# Altium project LoRaIoT.PrjPcb (part 2 of 3)

## Sheet [4] MCU.SchDoc: MCU STM32L052K8U6TR
size A4; CompanyName: RADWAG Wagi Elektroniczne; Organization: RADWAG Wagi Elektroniczne; Address1: ul. Bracka 28; Address2: 26-600 RADOM; Address3: POLAND; SheetNumber: 4; SheetTotal: 6
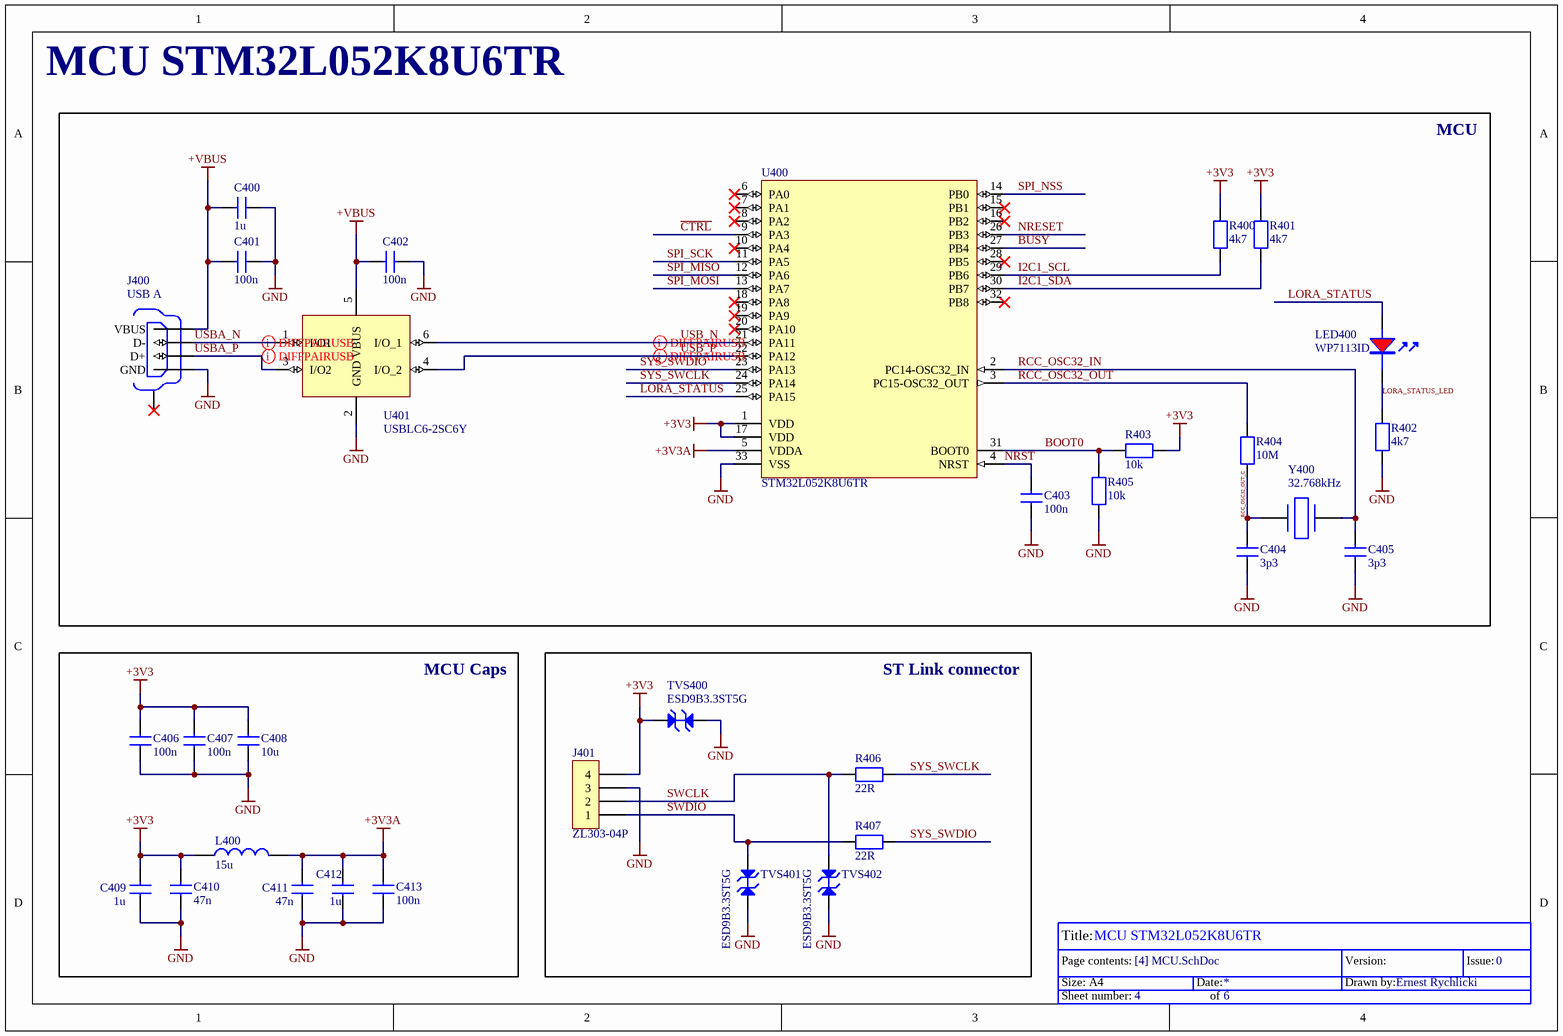
[diagram p3: [4] MCU.SchDoc]

### Parts
C400  1u  [C0402]
C401  100n  [C0402]
C402  100n  [C0402]
C403  100n  [C0603]
C404  3p3  [C0402]
C405  3p3  [C0402]
C406  100n  [C0402]
C407  100n  [C0402]
C408  10u  [C0402]
C409  1u  [C0402]
C410  47n  [C0402]
C411  47n  [C0402]
C412  1u  [C0402]
C413  100n  [C0402]
J400  USB A  [CONN_USB_RT_ANG]
J401  ZL303-04P  [HEADER1X4 _2mm]
L400  15u  [L0805]
LED400  WP7113ID  [LED5mm]
R400  4k7  [R0603]
R401  4k7  [R0603]
R402  4k7  [R0603]
R403  10k  [R0603]
R404  10M  [R0603]
R405  10k  [R0603]
R406  22R  [R0603]
R407  22R  [R0603]
TVS400  ESD9B3.3ST5G  [SOD-923]
TVS401  ESD9B3.3ST5G  [SOD-923]
TVS402  ESD9B3.3ST5G  [SOD-923]
U400  STM32L052K8U6TR  [UFQFPN32]
U401  USBLC6-2SC6Y  [SOT23-6L]
Y400  32.768kHz  [OSCILATOR_2X1_2]

### Blocks framed on the sheet
MCU: C400-C405 J400 LED400 R400-R405 U400 U401 Y400
MCU Caps: C406-C413 L400
ST Link connector: J401 R406 R407 TVS400-TVS402

### Nets
+3V3: C406.2 C407.2 C408.2 C409.2 C410.2 J401.4 L400.1 R400.2 R401.2 R403.1 TVS400.1 U400.1(VDD) U400.17(VDD)
+3V3A: C411.2 C412.2 C413.2 L400.2 U400.5(VDDA)
+VBUS: C400.2 C401.2 C402.2 J400.1(VBUS) U401.5(VBUS)
GND: C400.1 C401.1 C402.1 C403.1 C404.2 C405.2 C406.1 C407.1 C408.1 C409.1 C410.1 C411.1 C412.1 C413.1 J400.4(GND) J401.3 R402.2 R405.1 TVS400.2 TVS401.2 TVS402.2 U400.33(VSS) U401.2(GND)
~{CTRL}: U400.9(PA3)
BOOT0: R403.2 R405.2 U400.31(BOOT0)
BUSY: U400.27(PB4)
I2C1_SCL: R400.1 U400.29(PB6)
I2C1_SDA: R401.1 U400.30(PB7)
LORA_STATUS: LED400.A U400.25(PA15)
LORA_STATUS_LED: LED400.K R402.1
NRESET: U400.26(PB3)
NRST: C403.2 U400.4(NRST)
RCC_OSC32_IN: C405.1 U400.2(PC14-OSC32_IN) Y400.2
RCC_OSC32_OUT: R404.2 U400.3(PC15-OSC32_OUT)
RCC_OSC32_OUT_C: C404.1 R404.1 Y400.1
SPI_MISO: U400.12(PA6)
SPI_MOSI: U400.13(PA7)
SPI_NSS: U400.14(PB0)
SPI_SCK: U400.11(PA5)
SWCLK: J401.2 R406.1 TVS402.1
SWDIO: J401.1 R407.1 TVS401.1
SYS_SWCLK: R406.2 U400.24(PA14)
SYS_SWDIO: R407.2 U400.23(PA13)
USB_N: U400.21(PA11) U401.6(I/O_1)
USB_P: U400.22(PA12) U401.4(I/O_2)
USBA_N: J400.2(D-) U401.1(I/O1)
USBA_P: J400.3(D+) U401.3(I/O2)

Not connected (* = marked no-connect by the designer): J400 0(SHELL)*; U400 6(PA0)* 7(PA1)* 8(PA2)* 10(PA4)* 15(PB1)* 16(PB2)* 18(PA8)* 19(PA9)* 20(PA10)* 28(PB5)* 32(PB8)*

### Layout directives
differential pair; net class USB: USB_N, USB_P, USBA_N, USBA_P

### Notes on the sheet
- Title:
- Size: A4
- Page contents:
- Date:
- Version:
- Drawn by:
- Issue:
- Sheet number:
- of

### Library data of the parts
C400 C409 C412 = 0402X105K100CT: Multilayer Ceramic Capacitor, 1 uF, 10%, X5r, 10 V, 0402 [1005 Metric]; Manufacturer: Walsin Technologies; Supplier: Arrow Electronics; Supplier Part Number: 0402X105K100CT; Manufacturer Part Number: 0402X105K100CT; RoHS: Yes; Category: Ceramic Capacitors; Stock: 760000; Pricing: 10000=0,0037, 20000=0,0027, 50000=0,0026, 100000=0,0025, 250000=0,0023 (USD); ComponentLink1URL: http://www.farnell.com/datasheets/2340522.pdf?src-supplier=Farnell; ComponentLink1Description: http://www.farnell.com/datasheets/2340522.pdf?src-supplier=Farnell; ComponentLink2URL: http://www.farnell.com/datasheets/1958513.pdf?src-supplier=Farnell; ComponentLink2Description: http://www.farnell.com/datasheets/1958513.pdf?src-supplier=Farnell; ComponentLink3URL: http://www.farnell.com/datasheets/1958513.pdf?src-supplier=Element14; ComponentLink3Description: http://www.farnell.com/datasheets/1958513.pdf?src-supplier=Element14; ComponentLink4URL: https://datasheet.octopart.com/0402X105K100CT-Walsin-Technologies-datasheet-128065749.pdf?src-supplier=Future+Electronics; ComponentLink4Description: https://datasheet.octopart.com/0402X105K100CT-Walsin-Technologies-datasheet-128065749.pdf?src-supplier=Future+Electronics; ComponentLink5URL: https://datasheet.octopart.com/0402X105K100CT-Walsin-Technologies-datasheet-62066062.pdf?src-supplier=TME; ComponentLink5Description: https://datasheet.octopart.com/0402X105K100CT-Walsin-Technologies-datasheet-62066062.pdf?src-supplier=TME; ComponentLink6URL: https://datasheet.octopart.com/0402X105K100CT-Walsin-Technologies-datasheet-136037192.pdf?src-supplier=TECHDesign; ComponentLink6Description: https://datasheet.octopart.com/0402X105K100CT-Walsin-Technologies-datasheet-136037192.pdf?src-supplier=TECHDesign
C401 C402 C406 C407 C413 = 04023C104KAT2A: Multilayer Ceramic Capacitor, 0.1 uF, 25 V, ± 10%, X7R, 0402 [1005 Metric]; Manufacturer: Kyocera AVX; Material: 4241ConductorMaterial; Value: 100nF; Voltage Rating: 25V; Supplier: Arrow Electronics; Supplier Part Number: 04023C104KAT2A; Manufacturer Part Number: 04023C104KAT2A; RoHS: Yes; Category: Ceramic Capacitors; Stock: 5700000; Pricing: 10000=0,0064, 20000=0,0061, 30000=0,0058, 50000=0,0052, 100000=0,0042, 150000=0,0038 (USD); Mounting Technology: Surface Mount; Case/Package: 0402; Pins: 2; Case Code (Metric): 1005; Case Code (Imperial): 0402; Min Operating Temperature: -55°C; Max Operating Temperature: 125°C; Tolerance: 10%; Dielectric: X7R; Packaging: Cut Tape; Voltage Rating (DC): 25V; Voltage: 25V; Series: -; Width: 1mm; Reach SVHC Compliant: No; Lead Free: Lead Free; RoHS Compliant: Yes; ComponentLink1URL: https://datasheet.ciiva.com/6265/cx7r-6265272.pdf?src-supplier=Digi-Key; ComponentLink1Description: https://datasheet.ciiva.com/6265/cx7r-6265272.pdf?src-supplier=Digi-Key; ComponentLink2URL: https://datasheet.ciiva.com/1123/1679506-1123344.pdf?src-supplier=Element14; ComponentLink2Description: https://datasheet.ciiva.com/1123/1679506-1123344.pdf?src-supplier=Element14; ComponentLink3URL: https://datasheet.ciiva.com/7709/1679506-7709527.pdf?src-supplier=Element14; ComponentLink3Description: https://datasheet.ciiva.com/7709/1679506-7709527.pdf?src-supplier=Element14; ComponentLink4URL: https://datasheet.ciiva.com/14906/cx7r-14906223.pdf?src-supplier=Digi-Key; ComponentLink4Description: https://datasheet.ciiva.com/14906/cx7r-14906223.pdf?src-supplier=Digi-Key; ComponentLink5URL: https://datasheet.ciiva.com/7614/cx7r-7614663.pdf?src-supplier=Digi-Key; ComponentLink5Description: https://datasheet.ciiva.com/7614/cx7r-7614663.pdf?src-supplier=Digi-Key
C403 = 06033C104K4T2A: 0603 0.1 uF 25 V ±10% Tolerance X7R Automotive Multilayer Ceramic Capacitor; Manufacturer: Kyocera AVX; Supplier: Arrow Electronics; Supplier Part Number: 06033C104K4T2A; Manufacturer Part Number: 06033C104K4T2A; RoHS: Yes; Category: Ceramic Capacitors; Stock: 28000; Pricing: 4000=0,0188, 8000=0,0175, 12000=0,0166, 20000=0,0164, 24000=0,0157, 100000=0,0126 (USD); ComponentLink1URL: https://datasheet.ciiva.com/11503/cauto-11503963.pdf?src-supplier=Avnet; ComponentLink1Description: https://datasheet.ciiva.com/11503/cauto-11503963.pdf?src-supplier=Avnet
C404 C405 = GRM1555C1H3R3BA01D: 0402 3.3 pF 50 V ±0.1 pF Tolerance C0G SMT Multilayer Ceramic Capacitor; Manufacturer: Murata; Supplier: Arrow Electronics; Supplier Part Number: GRM1555C1H3R3BA01D; Manufacturer Part Number: GRM1555C1H3R3BA01D; RoHS: Yes; Category: Ceramic Capacitors; Stock: 38428; Pricing: 1=0,056, 10=0,0157, 25=0,0153, 100=0,0095, 250=0,0094, 500=0,0089, 1000=0,0084, 3000=0,0078, 6000=0,0073, 15000=0,0068, 30000=0,0063 (USD); ComponentLink1URL: https://datasheet.ciiva.com/6270/grm1555c1h3r0wa01-01-6270835.pdf?src-supplier=Digi-Key; ComponentLink1Description: https://datasheet.ciiva.com/6270/grm1555c1h3r0wa01-01-6270835.pdf?src-supplier=Digi-Key; ComponentLink2URL: https://datasheet.ciiva.com/18184/getdatasheetpartid-318269-18184366.pdf?src-supplier=Verical; ComponentLink2Description: https://datasheet.ciiva.com/18184/getdatasheetpartid-318269-18184366.pdf?src-supplier=Verical; ComponentLink3URL: https://datasheet.ciiva.com/11614/product-11614449.pdf?src-supplier=Avnet; ComponentLink3Description: https://datasheet.ciiva.com/11614/product-11614449.pdf?src-supplier=Avnet; ComponentLink4URL: https://datasheet.ciiva.com/3779/grm1555c1h3r3ba0123-3779149.pdf?src-supplier=Arrow+Electronics; ComponentLink4Description: https://datasheet.ciiva.com/3779/grm1555c1h3r3ba0123-3779149.pdf?src-supplier=Arrow+Electronics; ComponentLink5URL: https://datasheet.ciiva.com/6270/partnumbering-e-01-6270837.pdf?src-supplier=Digi-Key; ComponentLink5Description: https://datasheet.ciiva.com/6270/partnumbering-e-01-6270837.pdf?src-supplier=Digi-Key; ComponentLink6URL: https://datasheet.ciiva.com/6270/partnumbering-e-01-6270839.pdf?src-supplier=Digi-Key; ComponentLink6Description: https://datasheet.ciiva.com/6270/partnumbering-e-01-6270839.pdf?src-supplier=Digi-Key
C408 = GRJ155R60J106ME11D: Capacitor Ceramic Mlcc 0402 10UF 6.3V SMD; Manufacturer: Murata; Tolerance: 20%; Supplier: Arrow Electronics; Supplier Part Number: GRJ155R60J106ME11D; Manufacturer Part Number: GRJ155R60J106ME11D; RoHS: Yes; Category: Ceramic Capacitors; Stock: 10000; Pricing: 10000=0,0311, 20000=0,0295, 30000=0,0278, 50000=0,0262, 100000=0,0221, 250000=0,0204 (USD); Mounting Technology: Surface Mount; Case/Package: 0402; Case Code (Metric): 1005; Case Code (Imperial): 0402; Min Operating Temperature: -55°C; Max Operating Temperature: 85°C; Packaging: Cut Tape; Value: 10uF; Voltage Rating: 6.3V; Features: Soft Termination; Series: GRJ; Length: 0.039inch; Width: 0.02inch; Thickness: 0.028inch; RoHS Compliant: Yes; ComponentLink1URL: https://datasheet.octopart.com/GRJ155R60J106ME11D-Murata-datasheet-149522788.pdf?src-supplier=Newark; ComponentLink1Description: https://datasheet.octopart.com/GRJ155R60J106ME11D-Murata-datasheet-149522788.pdf?src-supplier=Newark; ComponentLink2URL: http://psearch.en.murata.com/capacitor/product/GRJ155R60J106ME11%23.pdf?src-supplier=Digi-Key; ComponentLink2Description: http://psearch.en.murata.com/capacitor/product/GRJ155R60J106ME11%23.pdf?src-supplier=Digi-Key; ComponentLink3URL: https://datasheet.octopart.com/GRJ155R60J106ME11D-Murata-datasheet-165579666.pdf?src-supplier=TME; ComponentLink3Description: https://datasheet.octopart.com/GRJ155R60J106ME11D-Murata-datasheet-165579666.pdf?src-supplier=TME
C410 C411 = GRM155R71C473KA01J: Cap Ceramic 0.047uF 16V X7R 10% SMD 0402 125°C Paper T/R; Manufacturer: Murata; Supplier: Arrow Electronics; Supplier Part Number: GRM155R71C473KA01J; Manufacturer Part Number: GRM155R71C473KA01J; RoHS: Yes; Category: Ceramic Capacitors; Stock: 49468; Pricing: 1=0,091, 10=0,01, 25=0,0098, 100=0,0064, 250=0,0063, 500=0,0055, 1000=0,0039, 3000=0,0035, 15000=0,0033, 30000=0,0028 (USD); ComponentLink1URL: https://datasheet.ciiva.com/11608/product-11608168.pdf?src-supplier=Avnet; ComponentLink1Description: https://datasheet.ciiva.com/11608/product-11608168.pdf?src-supplier=Avnet; ComponentLink2URL: https://datasheet.ciiva.com/163/partnumbering-e-01-163786.pdf?src-supplier=Digi-Key; ComponentLink2Description: https://datasheet.ciiva.com/163/partnumbering-e-01-163786.pdf?src-supplier=Digi-Key
J400 = 0676430910: CONN USB RT ANG RECPT TYPE A BLK; Manufacturer: Molex; Supplier: Mouser; Supplier Part Number: 538-67643-0910; Manufacturer Part Number: 0676430910; RoHS: Yes; Stock: 4035; Pricing: 1=1,46, 10=1,13, 50=1,13, 100=1,05, 1000=0,894, 10000=0,83 (USD); ComponentLink1URL: https://datasheet.ciiva.com/6733/676430910-sd-6733437.pdf?src-supplier=Digi-Key; ComponentLink1Description: https://datasheet.ciiva.com/6733/676430910-sd-6733437.pdf?src-supplier=Digi-Key
J401 = ZL303-04P: Pin Header, 4-Pin, 2mm
L400 = MLZ2012M150WT000: Inductor Power Shielded Multi-Layer 15uH 20% 2MHz Ferrite 0.25A 1.235Ohm DCR 0805 T/R; Manufacturer: TDK; Self Resonant Frequency: 40MHz; Saturation Current: 120mA; DC Resistance (DCR): 950mR; Supplier: Arrow Electronics; Supplier Part Number: MLZ2012M150WT000; Manufacturer Part Number: MLZ2012M150WT000; RoHS: Yes; Category: Fixed Inductors; Stock: 2000; Pricing: 2000=0,039, 10000=0,037, 24000=0,036, 50000=0,035, 100000=0,034 (USD); Mounting Technology: Surface Mount; Case/Package: 0805; Case Code (Metric): 2012; Case Code (Imperial): 0805; Core Material: Ferrite; Min Operating Temperature: -55°C; Max Operating Temperature: 125°C; Packaging: Cut Tape; Value: 15uH; Tolerance: 20%; Shielding: Shielded; Test Frequency: 2MHz; Series: MLZ; RoHS Compliant: Yes; ComponentLink1URL: https://datasheet.ciiva.com/29690/inductor-commercial-decoupling-mlz-en-29690328.pdf?src-supplier=Digi-Key; ComponentLink1Description: https://datasheet.ciiva.com/29690/inductor-commercial-decoupling-mlz-en-29690328.pdf?src-supplier=Digi-Key; ComponentLink2URL: https://datasheet.ciiva.com/29690/inductor-commercial-decoupling-mlz-en-29690327.pdf?src-supplier=Digi-Key; ComponentLink2Description: https://datasheet.ciiva.com/29690/inductor-commercial-decoupling-mlz-en-29690327.pdf?src-supplier=Digi-Key; ComponentLink3URL: https://datasheet.ciiva.com/29690/inductor-commercial-decoupling-mlz-en-29690329.pdf?src-supplier=Digi-Key; ComponentLink3Description: https://datasheet.ciiva.com/29690/inductor-commercial-decoupling-mlz-en-29690329.pdf?src-supplier=Digi-Key
LED400 = WP7113ID: Red T-1 3/4 5 mm 30° 50 mcd 2.2 V Tinted Solid State LED Lamp Through Hole; Manufacturer: Kingbright; Supplier: Mouser; Supplier Part Number: 604-WP7113ID; Manufacturer Part Number: WP7113ID; RoHS: Yes; Category: LEDs; Stock: 35900; Pricing: 1=0,1, 10=0,072, 50=0,072, 100=0,072, 1000=0,068, 10000=0,06 (USD); ComponentLink1URL: https://datasheet.ciiva.com/2114/wp7113id-2114384.pdf?src-supplier=Digi-Key; ComponentLink1Description: https://datasheet.ciiva.com/2114/wp7113id-2114384.pdf?src-supplier=Digi-Key; ComponentLink2URL: https://datasheet.ciiva.com/4692/wp7113id-48891-4692862.pdf?src-supplier=Mouser; ComponentLink2Description: https://datasheet.ciiva.com/4692/wp7113id-48891-4692862.pdf?src-supplier=Mouser; ComponentLink3URL: https://datasheet.ciiva.com/16210/wp7113id-16210118.pdf?src-supplier=Future+Electronics; ComponentLink3Description: https://datasheet.ciiva.com/16210/wp7113id-16210118.pdf?src-supplier=Future+Electronics
R400-R402 = AF0603FR-074K7L: Res Thick Film 0603 4.7K Ohm 1% 1/10W ±100ppm/°C Molded SMD Paper T/R; Manufacturer: Yageo; Supplier: Arrow Electronics; Supplier Part Number: AF0603FR-074K7L; Manufacturer Part Number: AF0603FR-074K7L; RoHS: Yes; Category: Chip SMD Resistors; Stock: 178; Pricing: 1=0,0339, 10=0,0163, 25=0,0156, 100=0,0114 (USD); ComponentLink1URL: http://www.mouser.com/ds/2/447/PYu-AF_51_RoHS_L_5-1085711.pdf?src-supplier=Mouser; ComponentLink1Description: http://www.mouser.com/ds/2/447/PYu-AF_51_RoHS_L_5-1085711.pdf?src-supplier=Mouser; ComponentLink2URL: https://datasheet.octopart.com/AF0603FR-074K7L-Yageo-datasheet-164730775.pdf?src-supplier=Future+Electronics; ComponentLink2Description: https://datasheet.octopart.com/AF0603FR-074K7L-Yageo-datasheet-164730775.pdf?src-supplier=Future+Electronics; ComponentLink3URL: http://www.yageo.com/documents/recent/PYu-AF_51_RoHS_L_5.pdf?src-supplier=Digi-Key; ComponentLink3Description: http://www.yageo.com/documents/recent/PYu-AF_51_RoHS_L_5.pdf?src-supplier=Digi-Key
R403 R405 = AC0603JR-0710KL: SMD Chip Resistor, 10 kOhm, ± 5%, 100 mW, 0603 [1608 Metric], Thick Film, General Purpose; Manufacturer: Yageo; Voltage Rating: 50V; Value: 10kR; Power Rating: 100mW; Temperature Coefficient: 100ppm/°C; Supplier: Arrow Electronics; Supplier Part Number: AC0603JR-0710KL; Manufacturer Part Number: AC0603JR-0710KL; RoHS: Yes; Category: Chip SMD Resistors; Stock: 801; Pricing: 1=0,0527, 10=0,012, 25=0,0107, 100=0,007, 250=0,0069, 500=0,0062 (USD); Case/Package: 0603; Case Code (Imperial): 0603; Case Code (Metric): 1608; Min Operating Temperature: -55°C; Max Operating Temperature: 155°C; Packaging: Tape and Reel; Tolerance: 5%; Termination: SMD/SMT; Number of Terminations: 2; Max Power Dissipation: 100mW; Features: Moisture Resistant,Automotive AEC-Q200; Series: AC; Ratings: AEC-Q200; Lead Free: Lead Free; RoHS Compliant: Yes; ComponentLink1URL: https://datasheet.ciiva.com/5562/pyu-ac-51-rohs-l-2-5562553.pdf?src-supplier=Mouser; ComponentLink1Description: https://datasheet.ciiva.com/5562/pyu-ac-51-rohs-l-2-5562553.pdf?src-supplier=Mouser
R404 = RC0603FR-0710ML: SMD Chip Resistor, 10 MOhm, ± 1%, 100 mW, 0603 [1608 Metric], Thick Film, General Purpose; Manufacturer: Yageo; Voltage Rating: 50V; Value: 10MR; Power Rating: 100mW; Tolerance: 5%; Temperature Coefficient: 100ppm/°C; Supplier: Arrow Electronics; Supplier Part Number: RC0603FR-0710ML; Manufacturer Part Number: RC0603FR-0710ML; RoHS: Yes; Category: Chip SMD Resistors; Stock: 125000; Pricing: 5000=0,002 (USD); Case/Package: 0603; Pins: 2; Case Code (Metric): 1608; Case Code (Imperial): 0603; Min Operating Temperature: -55°C; Max Operating Temperature: 155°C; Voltage Rating (DC): 50V; Packaging: Tape and Reel; Resistor Type: Thick Film; Number of Terminations: 2; Termination: SMD/SMT; Max Power Dissipation: 100mW; Features: Moisture Resistant; Series: RC; Resistance Tolerance: 1%; Construction: Rectangular; Technology: THICK FILM; Voltage Rating (AC): 50V; Length: 1.6mm; Width: 0.8mm; Height: 0.45mm; Depth: 0.8mm; Reach SVHC Compliant: No; Military Standard: Not; RoHS Compliant: Yes; Lead Free: 5697LeadFree; ComponentLink1URL: https://datasheet.ciiva.com/11808/0900766b80f96399-11808122.pdf?src-supplier=Rs; ComponentLink1Description: https://datasheet.ciiva.com/11808/0900766b80f96399-11808122.pdf?src-supplier=Rs; ComponentLink2URL: https://datasheet.ciiva.com/22763/1686128-22763599.pdf?src-supplier=Farnell; ComponentLink2Description: https://datasheet.ciiva.com/22763/1686128-22763599.pdf?src-supplier=Farnell; ComponentLink3URL: https://datasheet.ciiva.com/46393/1868787-46393000.pdf?src-supplier=Element14; ComponentLink3Description: https://datasheet.ciiva.com/46393/1868787-46393000.pdf?src-supplier=Element14; ComponentLink4URL: https://datasheet.ciiva.com/2453/pyu-r-int-thick-7-2453905.pdf?src-supplier=Digi-Key; ComponentLink4Description: https://datasheet.ciiva.com/2453/pyu-r-int-thick-7-2453905.pdf?src-supplier=Digi-Key; ComponentLink5URL: https://datasheet.ciiva.com/2453/pyu-r-int-thick-7-2453906.pdf?src-supplier=Digi-Key; ComponentLink5Description: https://datasheet.ciiva.com/2453/pyu-r-int-thick-7-2453906.pdf?src-supplier=Digi-Key; ComponentLink6URL: https://datasheet.ciiva.com/2453/pyu-r-int-thick-7-2453904.pdf?src-supplier=Digi-Key; ComponentLink6Description: https://datasheet.ciiva.com/2453/pyu-r-int-thick-7-2453904.pdf?src-supplier=Digi-Key
R406 R407 = RC0603JR-0722RL: SMD Chip Resistor, 22 Ohm, ± 5%, 100 mW, 0603 [1608 Metric], Thick Film, General Purpose; Manufacturer: Yageo; Voltage Rating (AC): 50V; Supplier: Arrow Electronics; Supplier Part Number: RC0603JR-0722RL; Manufacturer Part Number: RC0603JR-0722RL; RoHS: Yes; Category: Chip SMD Resistors; Stock: 4035; Pricing: 1=0,0925, 10=0,0259, 25=0,0135, 100=0,005, 250=0,0047, 500=0,0043, 1000=0,0042, 3000=0,0026 (USD); ComponentLink1URL: https://datasheet.ciiva.com/7746/443971-7746471.pdf?src-supplier=Element14; ComponentLink1Description: https://datasheet.ciiva.com/7746/443971-7746471.pdf?src-supplier=Element14; ComponentLink2URL: https://datasheet.ciiva.com/7746/443971-7746472.pdf?src-supplier=Element14; ComponentLink2Description: https://datasheet.ciiva.com/7746/443971-7746472.pdf?src-supplier=Element14; ComponentLink3URL: https://datasheet.ciiva.com/46394/443971-46394999.pdf?src-supplier=Element14; ComponentLink3Description: https://datasheet.ciiva.com/46394/443971-46394999.pdf?src-supplier=Element14; ComponentLink4URL: https://datasheet.ciiva.com/15189/getdatasheetpartid-493085-15189862.pdf?src-supplier=Verical; ComponentLink4Description: https://datasheet.ciiva.com/15189/getdatasheetpartid-493085-15189862.pdf?src-supplier=Verical
TVS400-TVS402 = ESD9B3.3ST5G: 11.5V 2A 3.3V (Max) 5V Bidirectional SOD-923 ESD Protection Devices ROHS; Manufacturer: ON Semiconductor; Number of Bidirectional Channels: 1; Power Line Protection: No; Diode Type: ZENER; Value: 15pF; Clamping Voltage: 10.5V; Leakage Current: 1uA; Peak Pulse Power: 300mW; ESD Protection: Yes; Test Current: 1mA; Supplier: Arrow Electronics; Supplier Part Number: ESD9B3.3ST5G; Manufacturer Part Number: ESD9B3.3ST5G; RoHS: Yes; Category: ESD and Circuit Protection ICs; Stock: 102; Pricing: 1=0,1559, 10=0,1305, 25=0,108, 100=0,067 (USD); Case/Package: SOD-923-2; Pins: 2; Min Operating Temperature: -55°C; Max Operating Temperature: 150°C; Packaging: Tape and Reel; Operating Supply Voltage: 3.3V; Reverse Standoff Voltage: 3.3V; Min Breakdown Voltage: 5V; Peak Pulse Current: 2A; Series: -; Package Quantity: 8000; Number of Elements: 1; Reverse Breakdown Voltage: 5V; Direction: Bidirectional; Breakdown Voltage: 5V; Number of Channels: 1; Polarity: Bidirectional; Termination: SMD/SMT; Working Voltage: 3.3V; Max Reverse Leakage Current: 1uA; Max Power Dissipation: 300mW; Number of Lines: 1; Length: 0.8mm; Width: 0.65mm; Height: 0.4mm; Depth: 0.6mm; Radiation Hardening: No; Lead Free: Lead Free; Reach SVHC Compliant: No; Halogen Free: Halogen Free; RoHS Compliant: Yes; ComponentLink1URL: https://datasheet.ciiva.com/339/esd9b-d-339712.pdf?src-supplier=Mouser; ComponentLink1Description: https://datasheet.ciiva.com/339/esd9b-d-339712.pdf?src-supplier=Mouser; ComponentLink2URL: https://datasheet.ciiva.com/22642/1596367-22642026.pdf?src-supplier=Element14; ComponentLink2Description: https://datasheet.ciiva.com/22642/1596367-22642026.pdf?src-supplier=Element14; ComponentLink3URL: https://datasheet.ciiva.com/22642/1596367-22642028.pdf?src-supplier=Element14; ComponentLink3Description: https://datasheet.ciiva.com/22642/1596367-22642028.pdf?src-supplier=Element14; ComponentLink4URL: https://datasheet.ciiva.com/11193/esd9b-d-11193999.pdf?src-supplier=Avnet; ComponentLink4Description: https://datasheet.ciiva.com/11193/esd9b-d-11193999.pdf?src-supplier=Avnet; ComponentLink5URL: https://datasheet.ciiva.com/26917/getdatasheetpartid-292713-26917946.pdf?src-supplier=Verical; ComponentLink5Description: https://datasheet.ciiva.com/26917/getdatasheetpartid-292713-26917946.pdf?src-supplier=Verical
U400 = STM32L052K8U6TR: Ultra-low power ARM Cortex-M0+ MCU with 64-Kbyte Flash, 32 MHz CPU, USB; Manufacturer: STMicroelectronics; Number of Timers/Counters: 4NUMBER; Density: 64KB; Nominal Supply Current: 290nA; Number of Channels: 10NUMBER; Number of D/A Converters: 1NUMBER; Supplier: Mouser; Supplier Part Number: 511-STM32L052K8U6TR; Manufacturer Part Number: STM32L052K8U6TR; RoHS: Yes; Category: Microcontrollers; Stock: 12130; Pricing: 1=4,52, 10=4,06, 50=3,84, 100=3,33, 1000=2,39, 10000=2,19 (USD); Number of I2C Channels: 1NUMBER; Number of SPI Channels: 1NUMBER; ComponentLink1URL: http://www.mouser.com/ds/2/389/stm32l052c6-956243.pdf?src-supplier=Mouser; ComponentLink1Description: http://www.mouser.com/ds/2/389/stm32l052c6-956243.pdf?src-supplier=Mouser; ComponentLink2URL: http://www.farnell.com/datasheets/1964277.pdf?src-supplier=Farnell; ComponentLink2Description: http://www.farnell.com/datasheets/1964277.pdf?src-supplier=Farnell; ComponentLink3URL: http://www.st.com/content/ccc/resource/technical/document/datasheet/dc/d6/6d/24/86/2a/40/d3/DM00108217.pdf/files/DM00108217.pdf/jcr:content/translations/en.DM00108217.pdf?src-supplier=Digi-Key; ComponentLink3Description: http://www.st.com/content/ccc/resource/technical/document/datasheet/dc/d6/6d/24/86/2a/40/d3/DM00108217.pdf/files/DM00108217.pdf/jcr:content/translations/en.DM00108217.pdf?src-supplier=Digi-Key; ComponentLink4URL: https://datasheet.octopart.com/STM32L052K8U6TR-STMicroelectronics-datasheet-62336777.pdf?src-supplier=Future+Electronics; ComponentLink4Description: https://datasheet.octopart.com/STM32L052K8U6TR-STMicroelectronics-datasheet-62336777.pdf?src-supplier=Future+Electronics; ComponentLink5URL: http://www.st.com/st-web-ui/static/active/en/resource/technical/document/datasheet/DM00108217.pdf?src-supplier=Avnet; ComponentLink5Description: http://www.st.com/st-web-ui/static/active/en/resource/technical/document/datasheet/DM00108217.pdf?src-supplier=Avnet; ComponentLink6URL: https://datasheet.octopart.com/STM32L052K8U6TR-STMicroelectronics-datasheet-48110660.pdf?src-supplier=Newark; ComponentLink6Description: https://datasheet.octopart.com/STM32L052K8U6TR-STMicroelectronics-datasheet-48110660.pdf?src-supplier=Newark; ComponentLink7URL: https://datasheet.octopart.com/STM32L052K8U6TR-STMicroelectronics-datasheet-38726991.pdf?src-supplier=Element14; ComponentLink7Description: https://datasheet.octopart.com/STM32L052K8U6TR-STMicroelectronics-datasheet-38726991.pdf?src-supplier=Element14; ComponentLink8URL: https://datasheet.octopart.com/STM32L052K8U6TR-STMicroelectronics-datasheet-159009248.pdf?src-supplier=SHENGYU+ELECTRONICS; ComponentLink8Description: https://datasheet.octopart.com/STM32L052K8U6TR-STMicroelectronics-datasheet-159009248.pdf?src-supplier=SHENGYU+ELECTRONICS
U401 = USBLC6-2SC6Y: USBLC6 Series 2 Line 6 V Uni / Bi Directional ESD Protection - SOT-23-6; Manufacturer: STMicroelectronics; Direction: Unidirectional; Value: 3.5pF; Operating Supply Voltage: 1.1V; Number of Bidirectional Channels: 2; Reverse Standoff Voltage: 5.25V; Min Breakdown Voltage: 6V; Clamping Voltage: 17V; Power Line Protection: Yes; Leakage Current: 150nA; Test Current: 1mA; ESR: 330R; Peak Pulse Current: 5A; Supplier: Mouser; Supplier Part Number: 511-USBLC6-2SC6Y; Manufacturer Part Number: USBLC6-2SC6Y; RoHS: Yes; Category: TVS Diodes; Stock: 6497; Pricing: 1=0,94, 10=0,847, 50=0,847, 100=0,691, 1000=0,541, 10000=0,426 (USD); Mounting Technology: Surface Mount; Case/Package: SOT-23; Pins: 6; Min Operating Temperature: -40°C; Max Operating Temperature: 150°C; Packaging: Tape and Reel; Package Quantity: 1; Number of Channels: 2; Breakdown Voltage: 6V; Termination: SMD/SMT; ESD Protection: Yes; Max Reverse Leakage Current: 150nA; Series: Automotive, AEC-Q101, USBY; Number of Unidirectional Channels: 2; Length: 3mm; Width: 1.75mm; Height: 1.45mm; Depth: 1.75mm; Radiation Hardening: No; Reach SVHC Compliant: No; Lead Free: Lead Free; RoHS Compliant: Yes; ComponentLink1URL: https://datasheet.ciiva.com/12326/dm00055262-101391-12326647.pdf?src-supplier=Mouser; ComponentLink1Description: https://datasheet.ciiva.com/12326/dm00055262-101391-12326647.pdf?src-supplier=Mouser; ComponentLink2URL: https://datasheet.ciiva.com/338/dm00055262-338888.pdf?src-supplier=Digi-Key; ComponentLink2Description: https://datasheet.ciiva.com/338/dm00055262-338888.pdf?src-supplier=Digi-Key; ComponentLink3URL: https://datasheet.ciiva.com/338/dm00055262-338887.pdf?src-supplier=Digi-Key; ComponentLink3Description: https://datasheet.ciiva.com/338/dm00055262-338887.pdf?src-supplier=Digi-Key; ComponentLink4URL: https://datasheet.ciiva.com/338/dm00055262-338889.pdf?src-supplier=Digi-Key; ComponentLink4Description: https://datasheet.ciiva.com/338/dm00055262-338889.pdf?src-supplier=Digi-Key; ComponentLink5URL: https://datasheet.ciiva.com/41442/001183856-da-01-en-diode-esd-2lin-usblc6-2sc6y-sot-23-6-stm-41442876.pdf?src-supplier=Conrad; ComponentLink5Description: https://datasheet.ciiva.com/41442/001183856-da-01-en-diode-esd-2lin-usblc6-2sc6y-sot-23-6-stm-41442876.pdf?src-supplier=Conrad
Y400 = CM8V-T1A 32.768kHz 7pF +/-20ppm TA QC: Tuning Fork Crystal SMD 32.768kHz 1.2x2.0mm; Manufacturer: Micro Crystal; Load Capacitance: 7pF; Frequency Tolerance: 20ppm; Supplier: Digi-Key; Supplier Part Number: 2195-CM8V-T1A-32.768KHZ-7PF-20PPM-TA-QCCT-ND; Manufacturer Part Number: CM8V-T1A 32.768kHz 7pF +/-20ppm TA QC; RoHS: Yes; Category: Uncategorized; Stock: 101880; Pricing: 1=0,6, 10=0,502, 50=0,4522, 100=0,402, 500=0,38188 (USD); Case/Package: SMD/SMT; Min Operating Temperature: -40°C; Max Operating Temperature: 85°C; Frequency: 32.768kHz; Length: 2mm; Width: 1.2mm; Height: 0.6mm; ComponentLink1URL: https://datasheet.ciiva.com/29123/001009262-da-01-en-uhrenquarz-cm8v-t1a-32-768-247-smd-29123814.pdf?src-supplier=Conrad; ComponentLink1Description: https://datasheet.ciiva.com/29123/001009262-da-01-en-uhrenquarz-cm8v-t1a-32-768-247-smd-29123814.pdf?src-supplier=Conrad

## Sheet [5] POWER.SchDoc: Power
size A4; CompanyName: RADWAG Wagi Elektroniczne; Organization: RADWAG Wagi Elektroniczne; Address1: ul. Bracka 28; Address2: 26-600 RADOM; Address3: POLAND; SheetNumber: 5; SheetTotal: 6
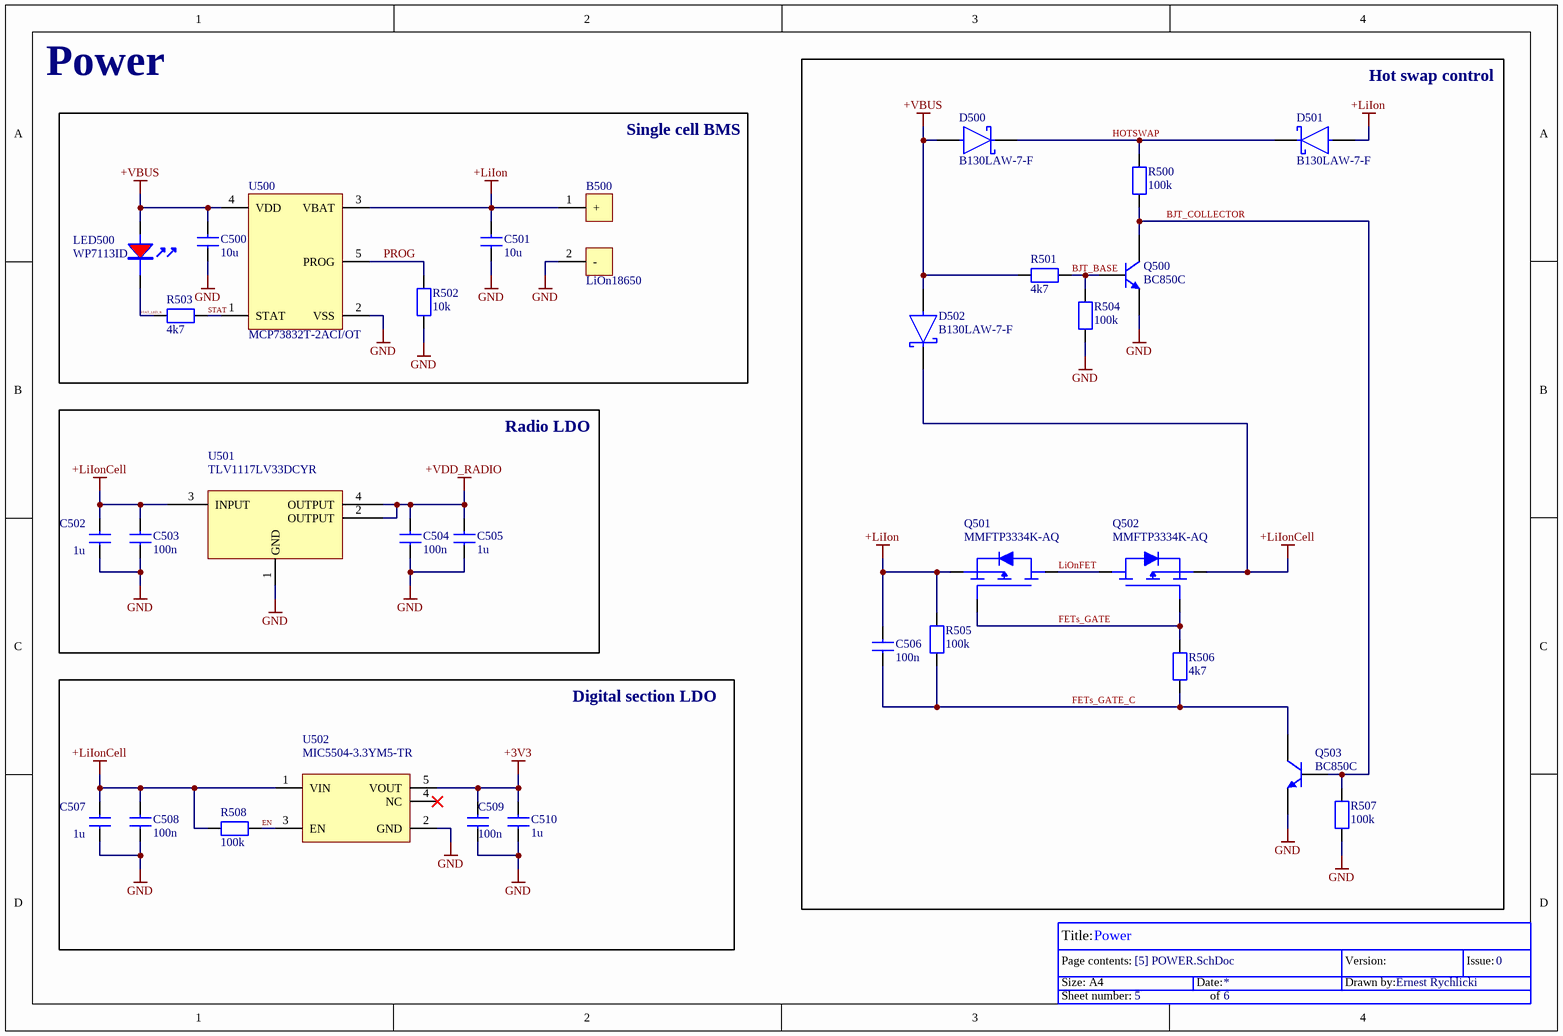
[diagram p4: [5] POWER.SchDoc]

### Parts
B500  LiOn18650  [LION18650]  (no BOM)
C500  10u  [C0402]
C501  10u  [C0402]
C502  1u  [C0402]
C503  100n  [C0402]
C504  100n  [C0402]
C505  1u  [C0402]
C506  100n  [C0402]
C507  1u  [C0402]
C508  100n  [C0402]
C509  100n  [C0402]
C510  1u  [C0402]
D500  B130LAW-7-F  [SOD-123]
D501  B130LAW-7-F  [SOD-123]
D502  B130LAW-7-F  [SOD-123]
LED500  WP7113ID  [LED5mm]
Q500  BC850C  [SOT23]
Q501  MMFTP3334K-AQ  [SOT23]
Q502  MMFTP3334K-AQ  [SOT23]
Q503  BC850C  [SOT23]
R500  100k  [R0603]
R501  4k7  [R0603]
R502  10k  [R0603]
R503  4k7  [R0603]
R504  100k  [R0603]
R505  100k  [R0603]
R506  4k7  [R0603]
R507  100k  [R0603]
R508  100k  [R0603]
U500  MCP73832T-2ACI/OT  [SOT23-5]
U501  TLV1117LV33DCYR  [SOT223-4]
U502  MIC5504-3.3YM5-TR  [SOT23-5]

### Blocks framed on the sheet
Hot swap control: C506 D500-D502 Q500-Q503 R500 R501 R504-R507
Single cell BMS: B500 C500 C501 LED500 R502 R503 U500
Radio LDO: C502-C505 U501
Digital section LDO: C507-C510 R508 U502

### Nets
+3V3: C509.2 C510.2 U502.5(VOUT)
+LiIon: B500.1(+) C501.2 C506.2 D501.2(A) Q501.2(S) R505.2 U500.3(VBAT)
+LiIonCell: C502.2 C503.2 C507.2 C508.2 D502.1(C) Q502.2(S) R508.2 U501.3(INPUT) U502.1(VIN)
+VBUS: C500.2 D500.2(A) D502.2(A) LED500.A R501.2 U500.4(VDD)
+VDD_RADIO: C504.2 C505.2 U501.2(OUTPUT) U501.4(OUTPUT)
GND: B500.2(-) C500.1 C501.1 C502.1 C503.1 C504.1 C505.1 C507.1 C508.1 C509.1 C510.1 Q500.2(E) Q503.2(E) R502.1 R504.1 R507.1 U500.2(VSS) U501.1(GND) U502.2(GND)
BJT_BASE: Q500.1(B) R501.1 R504.2
BJT_COLLECTOR: Q500.3(C) Q503.1(B) R500.1 R507.2
EN: R508.1 U502.3(EN)
FETs_GATE: Q501.1(G) Q502.1(G) R506.1
FETs_GATE_C: C506.1 Q503.3(C) R505.1 R506.2
HOTSWAP: D500.1(C) D501.1(C) R500.2
LiOnFET: Q501.3(D) Q502.3(D)
PROG: R502.2 U500.5(PROG)
STAT: R503.1 U500.1(STAT)
STAT_LED_K: LED500.K R503.2

Not connected (* = marked no-connect by the designer): U502 4(NC)*

### Notes on the sheet
- Title:
- Size: A4
- Page contents:
- Date:
- Version:
- Drawn by:
- Issue:
- Sheet number:
- of

### Library data of the parts
B500 = LiOn18650: LiOn18650 - single cell battery, soldered to PCB
C500 C501 = GRJ155R60J106ME11D: as C408 on sheet [4] MCU; Supplier: Arrow Electronics; Supplier Part Number: GRJ155R60J106ME11D; Manufacturer Part Number: GRJ155R60J106ME11D; RoHS: Yes; Category: Ceramic Capacitors; Stock: 10000; Pricing: 10000=0,0311, 20000=0,0295, 30000=0,0278, 50000=0,0262, 100000=0,0221, 250000=0,0204 (USD); Mounting Technology: Surface Mount; Case/Package: 0402; Case Code (Metric): 1005; Case Code (Imperial): 0402; Min Operating Temperature: -55°C; Max Operating Temperature: 85°C; Packaging: Cut Tape; Value: 10uF; Voltage Rating: 6.3V; Features: Soft Termination; Series: GRJ; Length: 0.039inch; Width: 0.02inch; Thickness: 0.028inch; RoHS Compliant: Yes; ComponentLink1URL: https://datasheet.octopart.com/GRJ155R60J106ME11D-Murata-datasheet-149522788.pdf?src-supplier=Newark; ComponentLink1Description: https://datasheet.octopart.com/GRJ155R60J106ME11D-Murata-datasheet-149522788.pdf?src-supplier=Newark; ComponentLink2URL: http://psearch.en.murata.com/capacitor/product/GRJ155R60J106ME11%23.pdf?src-supplier=Digi-Key; ComponentLink2Description: http://psearch.en.murata.com/capacitor/product/GRJ155R60J106ME11%23.pdf?src-supplier=Digi-Key; ComponentLink3URL: https://datasheet.octopart.com/GRJ155R60J106ME11D-Murata-datasheet-165579666.pdf?src-supplier=TME; ComponentLink3Description: https://datasheet.octopart.com/GRJ155R60J106ME11D-Murata-datasheet-165579666.pdf?src-supplier=TME
C502 C505 C507 C510 = 0402X105K100CT: as C400 on sheet [4] MCU; Supplier: Arrow Electronics; Supplier Part Number: 0402X105K100CT; Manufacturer Part Number: 0402X105K100CT; RoHS: Yes; Category: Ceramic Capacitors; Stock: 760000; Pricing: 10000=0,0037, 20000=0,0027, 50000=0,0026, 100000=0,0025, 250000=0,0023 (USD); ComponentLink1URL: http://www.farnell.com/datasheets/2340522.pdf?src-supplier=Farnell; ComponentLink1Description: http://www.farnell.com/datasheets/2340522.pdf?src-supplier=Farnell; ComponentLink2URL: http://www.farnell.com/datasheets/1958513.pdf?src-supplier=Farnell; ComponentLink2Description: http://www.farnell.com/datasheets/1958513.pdf?src-supplier=Farnell; ComponentLink3URL: http://www.farnell.com/datasheets/1958513.pdf?src-supplier=Element14; ComponentLink3Description: http://www.farnell.com/datasheets/1958513.pdf?src-supplier=Element14; ComponentLink4URL: https://datasheet.octopart.com/0402X105K100CT-Walsin-Technologies-datasheet-128065749.pdf?src-supplier=Future+Electronics; ComponentLink4Description: https://datasheet.octopart.com/0402X105K100CT-Walsin-Technologies-datasheet-128065749.pdf?src-supplier=Future+Electronics; ComponentLink5URL: https://datasheet.octopart.com/0402X105K100CT-Walsin-Technologies-datasheet-62066062.pdf?src-supplier=TME; ComponentLink5Description: https://datasheet.octopart.com/0402X105K100CT-Walsin-Technologies-datasheet-62066062.pdf?src-supplier=TME; ComponentLink6URL: https://datasheet.octopart.com/0402X105K100CT-Walsin-Technologies-datasheet-136037192.pdf?src-supplier=TECHDesign; ComponentLink6Description: https://datasheet.octopart.com/0402X105K100CT-Walsin-Technologies-datasheet-136037192.pdf?src-supplier=TECHDesign
C503 C504 C506 C508 C509 = 04023C104KAT2A: as C401 on sheet [4] MCU; Supplier: Arrow Electronics; Supplier Part Number: 04023C104KAT2A; Manufacturer Part Number: 04023C104KAT2A; RoHS: Yes; Category: Ceramic Capacitors; Stock: 5700000; Pricing: 10000=0,0064, 20000=0,0061, 30000=0,0058, 50000=0,0052, 100000=0,0042, 150000=0,0038 (USD); Mounting Technology: Surface Mount; Case/Package: 0402; Pins: 2; Case Code (Metric): 1005; Case Code (Imperial): 0402; Min Operating Temperature: -55°C; Max Operating Temperature: 125°C; Tolerance: 10%; Dielectric: X7R; Packaging: Cut Tape; Voltage Rating (DC): 25V; Voltage: 25V; Series: -; Width: 1mm; Reach SVHC Compliant: No; Lead Free: Lead Free; RoHS Compliant: Yes; ComponentLink1URL: https://datasheet.ciiva.com/6265/cx7r-6265272.pdf?src-supplier=Digi-Key; ComponentLink1Description: https://datasheet.ciiva.com/6265/cx7r-6265272.pdf?src-supplier=Digi-Key; ComponentLink2URL: https://datasheet.ciiva.com/1123/1679506-1123344.pdf?src-supplier=Element14; ComponentLink2Description: https://datasheet.ciiva.com/1123/1679506-1123344.pdf?src-supplier=Element14; ComponentLink3URL: https://datasheet.ciiva.com/7709/1679506-7709527.pdf?src-supplier=Element14; ComponentLink3Description: https://datasheet.ciiva.com/7709/1679506-7709527.pdf?src-supplier=Element14; ComponentLink4URL: https://datasheet.ciiva.com/14906/cx7r-14906223.pdf?src-supplier=Digi-Key; ComponentLink4Description: https://datasheet.ciiva.com/14906/cx7r-14906223.pdf?src-supplier=Digi-Key; ComponentLink5URL: https://datasheet.ciiva.com/7614/cx7r-7614663.pdf?src-supplier=Digi-Key; ComponentLink5Description: https://datasheet.ciiva.com/7614/cx7r-7614663.pdf?src-supplier=Digi-Key
D500-D502 = B130LAW-7-F: Rectifier Diode Schottky 30V 1A 2-Pin SOD-123 T/R / DIODE SCHOTTKY 30V 1A SOD123; Manufacturer: Diodes; Max Reverse Current: 1mA; Peak Non-Repetitive Surge Current: 12A; Forward Voltage: 420mV; Polarity: Standard; Value: 40pF; Supplier: Arrow Electronics; Supplier Part Number: B130LAW-7-F; Manufacturer Part Number: B130LAW-7-F; RoHS: Yes; Category: Rectifier Diodes; Stock: 93000; Pricing: 3000=0,0709 (USD); Mounting Technology: Surface Mount; Pins: 2; Weight: 0.000353oz; Contact Plating: Tin,Matte; Min Operating Temperature: -55°C; Max Operating Temperature: 125°C; Forward Current: 1A; Max Repetitive Reverse Voltage (Vrrm): 30V; Package Quantity: 3000; Packaging: Tape and Reel; Average Rectified Current: 1A; Max Forward Surge Current (Ifsm): 12A; Termination: SMD/SMT; Voltage Rating (DC): 30V; Current Rating: 1A; Output Current: 1A; Max Reverse Voltage (DC): 30V; Series: -; Reverse Voltage: 30V; Length: 2.85mm; Width: 1.7mm; Height: 1.25mm; Radiation Hardening: No; Reach SVHC Compliant: No; Lead Free: Lead Free; RoHS Compliant: Yes; ComponentLink1URL: https://datasheet.ciiva.com/913/ds30308-913553.pdf?src-supplier=Digi-Key; ComponentLink1Description: https://datasheet.ciiva.com/913/ds30308-913553.pdf?src-supplier=Digi-Key; ComponentLink2URL: https://datasheet.ciiva.com/34302/1538689-34302354.pdf?src-supplier=Jameco; ComponentLink2Description: https://datasheet.ciiva.com/34302/1538689-34302354.pdf?src-supplier=Jameco; ComponentLink3URL: https://datasheet.ciiva.com/4715/ds30308-79347-4715540.pdf?src-supplier=Mouser; ComponentLink3Description: https://datasheet.ciiva.com/4715/ds30308-79347-4715540.pdf?src-supplier=Mouser; ComponentLink4URL: https://datasheet.ciiva.com/1177/ds30308-1177411.pdf?src-supplier=Element14; ComponentLink4Description: https://datasheet.ciiva.com/1177/ds30308-1177411.pdf?src-supplier=Element14; ComponentLink5URL: https://datasheet.ciiva.com/22695/887879-22695783.pdf?src-supplier=Element14; ComponentLink5Description: https://datasheet.ciiva.com/22695/887879-22695783.pdf?src-supplier=Element14; ComponentLink6URL: https://datasheet.ciiva.com/8300/ds30308-8300503.pdf?src-supplier=Avnet; ComponentLink6Description: https://datasheet.ciiva.com/8300/ds30308-8300503.pdf?src-supplier=Avnet; ComponentLink7URL: https://datasheet.ciiva.com/8303/ds30308-8303245.pdf?src-supplier=Avnet; ComponentLink7Description: https://datasheet.ciiva.com/8303/ds30308-8303245.pdf?src-supplier=Avnet; ComponentLink8URL: https://datasheet.ciiva.com/913/ds30308-913554.pdf?src-supplier=Digi-Key; ComponentLink8Description: https://datasheet.ciiva.com/913/ds30308-913554.pdf?src-supplier=Digi-Key; ComponentLink9URL: https://datasheet.ciiva.com/913/ds30308-913555.pdf?src-supplier=Digi-Key; ComponentLink9Description: https://datasheet.ciiva.com/913/ds30308-913555.pdf?src-supplier=Digi-Key
LED500 = WP7113ID: as LED400 on sheet [4] MCU; Supplier: Mouser; Supplier Part Number: 604-WP7113ID; Manufacturer Part Number: WP7113ID; RoHS: Yes; Category: LEDs; Stock: 35900; Pricing: 1=0,1, 10=0,072, 50=0,072, 100=0,072, 1000=0,068, 10000=0,06 (USD); ComponentLink1URL: https://datasheet.ciiva.com/2114/wp7113id-2114384.pdf?src-supplier=Digi-Key; ComponentLink1Description: https://datasheet.ciiva.com/2114/wp7113id-2114384.pdf?src-supplier=Digi-Key; ComponentLink2URL: https://datasheet.ciiva.com/4692/wp7113id-48891-4692862.pdf?src-supplier=Mouser; ComponentLink2Description: https://datasheet.ciiva.com/4692/wp7113id-48891-4692862.pdf?src-supplier=Mouser; ComponentLink3URL: https://datasheet.ciiva.com/16210/wp7113id-16210118.pdf?src-supplier=Future+Electronics; ComponentLink3Description: https://datasheet.ciiva.com/16210/wp7113id-16210118.pdf?src-supplier=Future+Electronics
Q500 Q503 = BC850C: Trans GP BJT NPN 45V 0.1A 250mW Automotive 3-Pin SOT-23 T/R; Manufacturer: Diotec; Supplier: Mouser; Supplier Part Number: 637-BC850C; Manufacturer Part Number: BC850C; RoHS: Yes; Category: BJTs; Stock: 12088; Pricing: 1=0,18, 10=0,105, 50=0,105, 100=0,076, 1000=0,053, 10000=0,025 (USD); ComponentLink1URL: http://datasheet.octopart.com/BC850C-Diotec-datasheet-17564964.pdf?src-supplier=Verical; ComponentLink1Description: http://datasheet.octopart.com/BC850C-Diotec-datasheet-17564964.pdf?src-supplier=Verical; ComponentLink2URL: http://datasheet.octopart.com/BC850C-Diotec-datasheet-17564964.pdf?src-supplier=Mouser; ComponentLink2Description: http://datasheet.octopart.com/BC850C-Diotec-datasheet-17564964.pdf?src-supplier=Mouser; ComponentLink3URL: http://datasheet.octopart.com/BC850C-Diotec-datasheet-17564964.pdf?src-supplier=Distrelec; ComponentLink3Description: http://datasheet.octopart.com/BC850C-Diotec-datasheet-17564964.pdf?src-supplier=Distrelec; ComponentLink4URL: http://datasheet.octopart.com/BC850C-Diotec-datasheet-17564964.pdf?src-supplier=Onlinecomponents.com; ComponentLink4Description: http://datasheet.octopart.com/BC850C-Diotec-datasheet-17564964.pdf?src-supplier=Onlinecomponents.com; ComponentLink5URL: https://datasheet.octopart.com/BC850C-Diotec-datasheet-149503847.pdf?src-supplier=TME; ComponentLink5Description: https://datasheet.octopart.com/BC850C-Diotec-datasheet-149503847.pdf?src-supplier=TME; ComponentLink6URL: http://datasheet.octopart.com/BC850C-Diotec-datasheet-17564964.pdf?src-supplier=DComponents; ComponentLink6Description: http://datasheet.octopart.com/BC850C-Diotec-datasheet-17564964.pdf?src-supplier=DComponents; ComponentLink7URL: http://datasheet.octopart.com/BC850C-Diotec-datasheet-17564964.pdf?src-supplier=Electro+Sonic; ComponentLink7Description: http://datasheet.octopart.com/BC850C-Diotec-datasheet-17564964.pdf?src-supplier=Electro+Sonic
Q501 Q502 = MMFTP3334K-AQ: Mosfet, SOT-23, 30V, 4A, P, 1W; Manufacturer: Diotec; Supplier: Mouser; Supplier Part Number: 637-MMFTP3334K-AQ; Manufacturer Part Number: MMFTP3334K-AQ; RoHS: No; Category: Uncategorized; Pricing: 1=0,6, 10=0,51, 50=0,51, 100=0,401, 1000=0,32, 10000=0,126 (USD)
R500 R504 R505 R507 R508 = CRCW0603100KFKEBC: CRCW Thick Film Commodity Chip Resistor 0603 Size 100K Ohm 1% 0.1 W 100 ppm/K 2-Pin SMD Paper T/R; Manufacturer: Vishay; Value: 100kR; Max Power Dissipation: 100mW; Temperature Coefficient: 100ppm/°C; Supplier: Mouser; Supplier Part Number: 71-CRCW0603100KFKEBC; Manufacturer Part Number: CRCW0603100KFKEBC; RoHS: Yes; Category: Chip SMD Resistors; Stock: 86866; Pricing: 1=0,1, 10=0,018, 50=0,018, 100=0,008, 1000=0,006, 10000=0,003 (USD); Case/Package: 0603; Min Operating Temperature: -55°C; Max Operating Temperature: 155°C; Packaging: Tape and Reel; Tolerance: 1%; Number of Terminations: 2; Series: CRCW-C; RoHS Compliant: Yes; Lead Free: 5697LeadFree; ComponentLink1URL: http://www.vishay.com/docs/28773/crcwce3.pdf?src-supplier=Digi-Key; ComponentLink1Description: http://www.vishay.com/docs/28773/crcwce3.pdf?src-supplier=Digi-Key
R501 R503 R506 = AF0603FR-074K7L: as R400 on sheet [4] MCU; Supplier: Arrow Electronics; Supplier Part Number: AF0603FR-074K7L; Manufacturer Part Number: AF0603FR-074K7L; RoHS: Yes; Category: Chip SMD Resistors; Stock: 178; Pricing: 1=0,0339, 10=0,0163, 25=0,0156, 100=0,0114 (USD); ComponentLink1URL: http://www.mouser.com/ds/2/447/PYu-AF_51_RoHS_L_5-1085711.pdf?src-supplier=Mouser; ComponentLink1Description: http://www.mouser.com/ds/2/447/PYu-AF_51_RoHS_L_5-1085711.pdf?src-supplier=Mouser; ComponentLink2URL: https://datasheet.octopart.com/AF0603FR-074K7L-Yageo-datasheet-164730775.pdf?src-supplier=Future+Electronics; ComponentLink2Description: https://datasheet.octopart.com/AF0603FR-074K7L-Yageo-datasheet-164730775.pdf?src-supplier=Future+Electronics; ComponentLink3URL: http://www.yageo.com/documents/recent/PYu-AF_51_RoHS_L_5.pdf?src-supplier=Digi-Key; ComponentLink3Description: http://www.yageo.com/documents/recent/PYu-AF_51_RoHS_L_5.pdf?src-supplier=Digi-Key
R502 = AC0603JR-0710KL: as R403 on sheet [4] MCU; Supplier: Arrow Electronics; Supplier Part Number: AC0603JR-0710KL; Manufacturer Part Number: AC0603JR-0710KL; RoHS: Yes; Category: Chip SMD Resistors; Stock: 801; Pricing: 1=0,0527, 10=0,012, 25=0,0107, 100=0,007, 250=0,0069, 500=0,0062 (USD); Case/Package: 0603; Case Code (Imperial): 0603; Case Code (Metric): 1608; Min Operating Temperature: -55°C; Max Operating Temperature: 155°C; Packaging: Tape and Reel; Tolerance: 5%; Termination: SMD/SMT; Number of Terminations: 2; Max Power Dissipation: 100mW; Features: Moisture Resistant,Automotive AEC-Q200; Series: AC; Ratings: AEC-Q200; Lead Free: Lead Free; RoHS Compliant: Yes; ComponentLink1URL: https://datasheet.ciiva.com/5562/pyu-ac-51-rohs-l-2-5562553.pdf?src-supplier=Mouser; ComponentLink1Description: https://datasheet.ciiva.com/5562/pyu-ac-51-rohs-l-2-5562553.pdf?src-supplier=Mouser
U500 = MCP73832T-2ACI/OT: MCP73832 Series Single-Cell Li-Ion/Li-Polymer Battery Charge Controller SOT-23-5; Manufacturer: Microchip; Supplier: Arrow Electronics; Supplier Part Number: MCP73832T-2ACI/OT; Manufacturer Part Number: MCP73832T-2ACI/OT; RoHS: Yes; Category: Battery Management; Stock: 8708; Pricing: 1=0,7211, 10=0,7209, 25=0,7119, 100=0,7029, 250=0,6938, 500=0,6848, 1000=0,6758, 3000=0,6668, 6000=0,6578 (USD); ComponentLink1URL: https://datasheet.ciiva.com/1931/21984e-1931959.pdf?src-supplier=Digi-Key; ComponentLink1Description: https://datasheet.ciiva.com/1931/21984e-1931959.pdf?src-supplier=Digi-Key; ComponentLink2URL: https://datasheet.ciiva.com/1931/21984e-1931960.pdf?src-supplier=Digi-Key; ComponentLink2Description: https://datasheet.ciiva.com/1931/21984e-1931960.pdf?src-supplier=Digi-Key; ComponentLink3URL: https://datasheet.ciiva.com/1931/21984e-1931961.pdf?src-supplier=Digi-Key; ComponentLink3Description: https://datasheet.ciiva.com/1931/21984e-1931961.pdf?src-supplier=Digi-Key
U501 = TLV1117LV33DCYR: IC REG LDO 3.3V 1A SOT223; Manufacturer: Texas Instruments; Supplier: Mouser; Supplier Part Number: 595-TLV1117LV33DCYR; Manufacturer Part Number: TLV1117LV33DCYR; RoHS: Yes; Category: Voltage Regulators - Linear; Stock: 41813; Pricing: 1=0,35, 10=0,261, 50=0,261, 100=0,146, 1000=0,108, 10000=0,087 (USD); ComponentLink1URL: https://datasheet.ciiva.com/2060/tlv1117lv-2060226.pdf?src-supplier=Digi-Key; ComponentLink1Description: https://datasheet.ciiva.com/2060/tlv1117lv-2060226.pdf?src-supplier=Digi-Key; ComponentLink2URL: https://datasheet.ciiva.com/2060/tlv1117lv-2060227.pdf?src-supplier=Digi-Key; ComponentLink2Description: https://datasheet.ciiva.com/2060/tlv1117lv-2060227.pdf?src-supplier=Digi-Key; ComponentLink3URL: https://datasheet.ciiva.com/2060/tlv1117lv-2060228.pdf?src-supplier=Digi-Key; ComponentLink3Description: https://datasheet.ciiva.com/2060/tlv1117lv-2060228.pdf?src-supplier=Digi-Key; ComponentLink4URL: https://datasheet.ciiva.com/46443/1857581-46443437.pdf?src-supplier=Element14; ComponentLink4Description: https://datasheet.ciiva.com/46443/1857581-46443437.pdf?src-supplier=Element14; ComponentLink5URL: https://datasheet.ciiva.com/46443/1857581-46443438.pdf?src-supplier=Element14; ComponentLink5Description: https://datasheet.ciiva.com/46443/1857581-46443438.pdf?src-supplier=Element14; ComponentLink6URL: https://datasheet.ciiva.com/46443/1857581-46443450.pdf?src-supplier=Element14; ComponentLink6Description: https://datasheet.ciiva.com/46443/1857581-46443450.pdf?src-supplier=Element14
U502 = MIC5504-3.3YM5-TR: LDO Regulator Pos 3.3V 0.3A Medical 5-Pin SOT-23 T/R / IC REG LDO 3.3V 0.3A SOT-23-5; Manufacturer: Microchip; Supplier: Arrow Electronics; Supplier Part Number: MIC5504-3.3YM5-TR; Manufacturer Part Number: MIC5504-3.3YM5-TR; RoHS: Yes; Category: Voltage Regulators - Linear; Stock: 27000; Pricing: 3000=0,1186 (USD); ComponentLink1URL: https://datasheet.ciiva.com/46425/1856860-46425639.pdf?src-supplier=Element14; ComponentLink1Description: https://datasheet.ciiva.com/46425/1856860-46425639.pdf?src-supplier=Element14